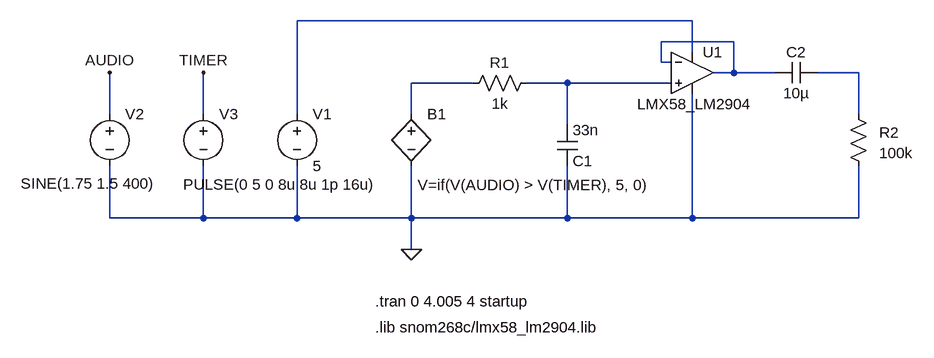
[diagram p0: schematic audio_output_stage.asc]
audio_output_stage.asc, the LTspice schematic file:
Version 4.1
SHEET 1 1120 732
WIRE 544 64 -64 64
WIRE 608 96 496 96
WIRE 544 112 544 64
WIRE 496 128 496 96
WIRE 512 128 496 128
WIRE 608 144 608 96
WIRE 608 144 576 144
WIRE 672 144 608 144
WIRE 800 144 736 144
WIRE 208 160 112 160
WIRE 352 160 288 160
WIRE 512 160 352 160
WIRE -352 208 -352 144
WIRE -208 208 -208 144
WIRE -64 208 -64 64
WIRE 112 208 112 160
WIRE 800 208 800 144
WIRE 352 224 352 160
WIRE -352 368 -352 288
WIRE -208 368 -208 288
WIRE -208 368 -352 368
WIRE -64 368 -64 288
WIRE -64 368 -208 368
WIRE 112 368 112 288
WIRE 112 368 -64 368
WIRE 352 368 352 288
WIRE 352 368 112 368
WIRE 544 368 544 176
WIRE 544 368 352 368
WIRE 800 368 800 288
WIRE 800 368 544 368
WIRE 112 416 112 368
FLAG 112 416 0
FLAG -352 144 AUDIO
FLAG -208 144 TIMER
SYMBOL voltage -352 192 R0
WINDOW 123 0 0 Left 0
WINDOW 39 0 0 Left 0
WINDOW 3 -137 123 Left 2
SYMATTR InstName V2
SYMATTR Value SINE(1.75 1.5 400)
SYMBOL voltage -64 192 R0
WINDOW 123 0 0 Left 0
WINDOW 39 0 0 Left 0
SYMATTR InstName V1
SYMATTR Value 5
SYMBOL res 304 144 R90
WINDOW 0 0 56 VBottom 2
WINDOW 3 32 56 VTop 2
SYMATTR InstName R1
SYMATTR Value 1k
SYMBOL cap 336 224 R0
WINDOW 0 24 56 Left 2
WINDOW 3 24 8 Left 2
SYMATTR InstName C1
SYMATTR Value 33n
SYMBOL cap 672 160 R270
WINDOW 0 32 32 VTop 2
WINDOW 3 0 32 VBottom 2
SYMATTR InstName C2
SYMATTR Value 10µ
SYMBOL res 784 192 R0
WINDOW 0 48 44 Left 2
WINDOW 3 48 76 Left 2
SYMATTR InstName R2
SYMATTR Value 100k
SYMBOL OpAmps\\opamp2 544 80 R0
WINDOW 3 -85 112 Left 2
SYMATTR InstName U1
SYMATTR Value LMX58_LM2904
SYMBOL voltage -208 192 R0
WINDOW 3 -31 124 Left 2
WINDOW 123 0 0 Left 0
WINDOW 39 0 0 Left 0
SYMATTR InstName V3
SYMATTR Value PULSE(0 5 0 8u 8u 1p 16u)
SYMBOL bv 112 192 R0
WINDOW 3 10 125 Left 2
SYMATTR InstName B1
SYMATTR Value V=if(V(AUDIO) > V(TIMER), 5, 0)
TEXT 56 496 Left 2 !.tran 0 4.005 4 startup
TEXT 56 536 Left 2 !.lib snom268c/lmx58_lm2904.lib

The netlist it stands for:
* audio_output_stage.asc
V2 AUDIO 0 SINE(1.75 1.5 400)
V1 N001 0 5
R1 N005 N004 1k
C1 N005 0 33n
C2 N002 N003 10µ
R2 N003 0 100k
X§U1 N005 N002 N001 0 N002 LMX58_LM2904  ; pins In+ In- V+ V- OUT
V3 TIMER 0 PULSE(0 5 0 8u 8u 1p 16u)
B1 N004 0 V=if(V(AUDIO) > V(TIMER), 5, 0)
.tran 0 4.005 4 startup
.lib snom268c/lmx58_lm2904.lib
.backanno
.end